# EAGLE schematic My GuitarPedal Schematic (EAGLE 9.6.2)
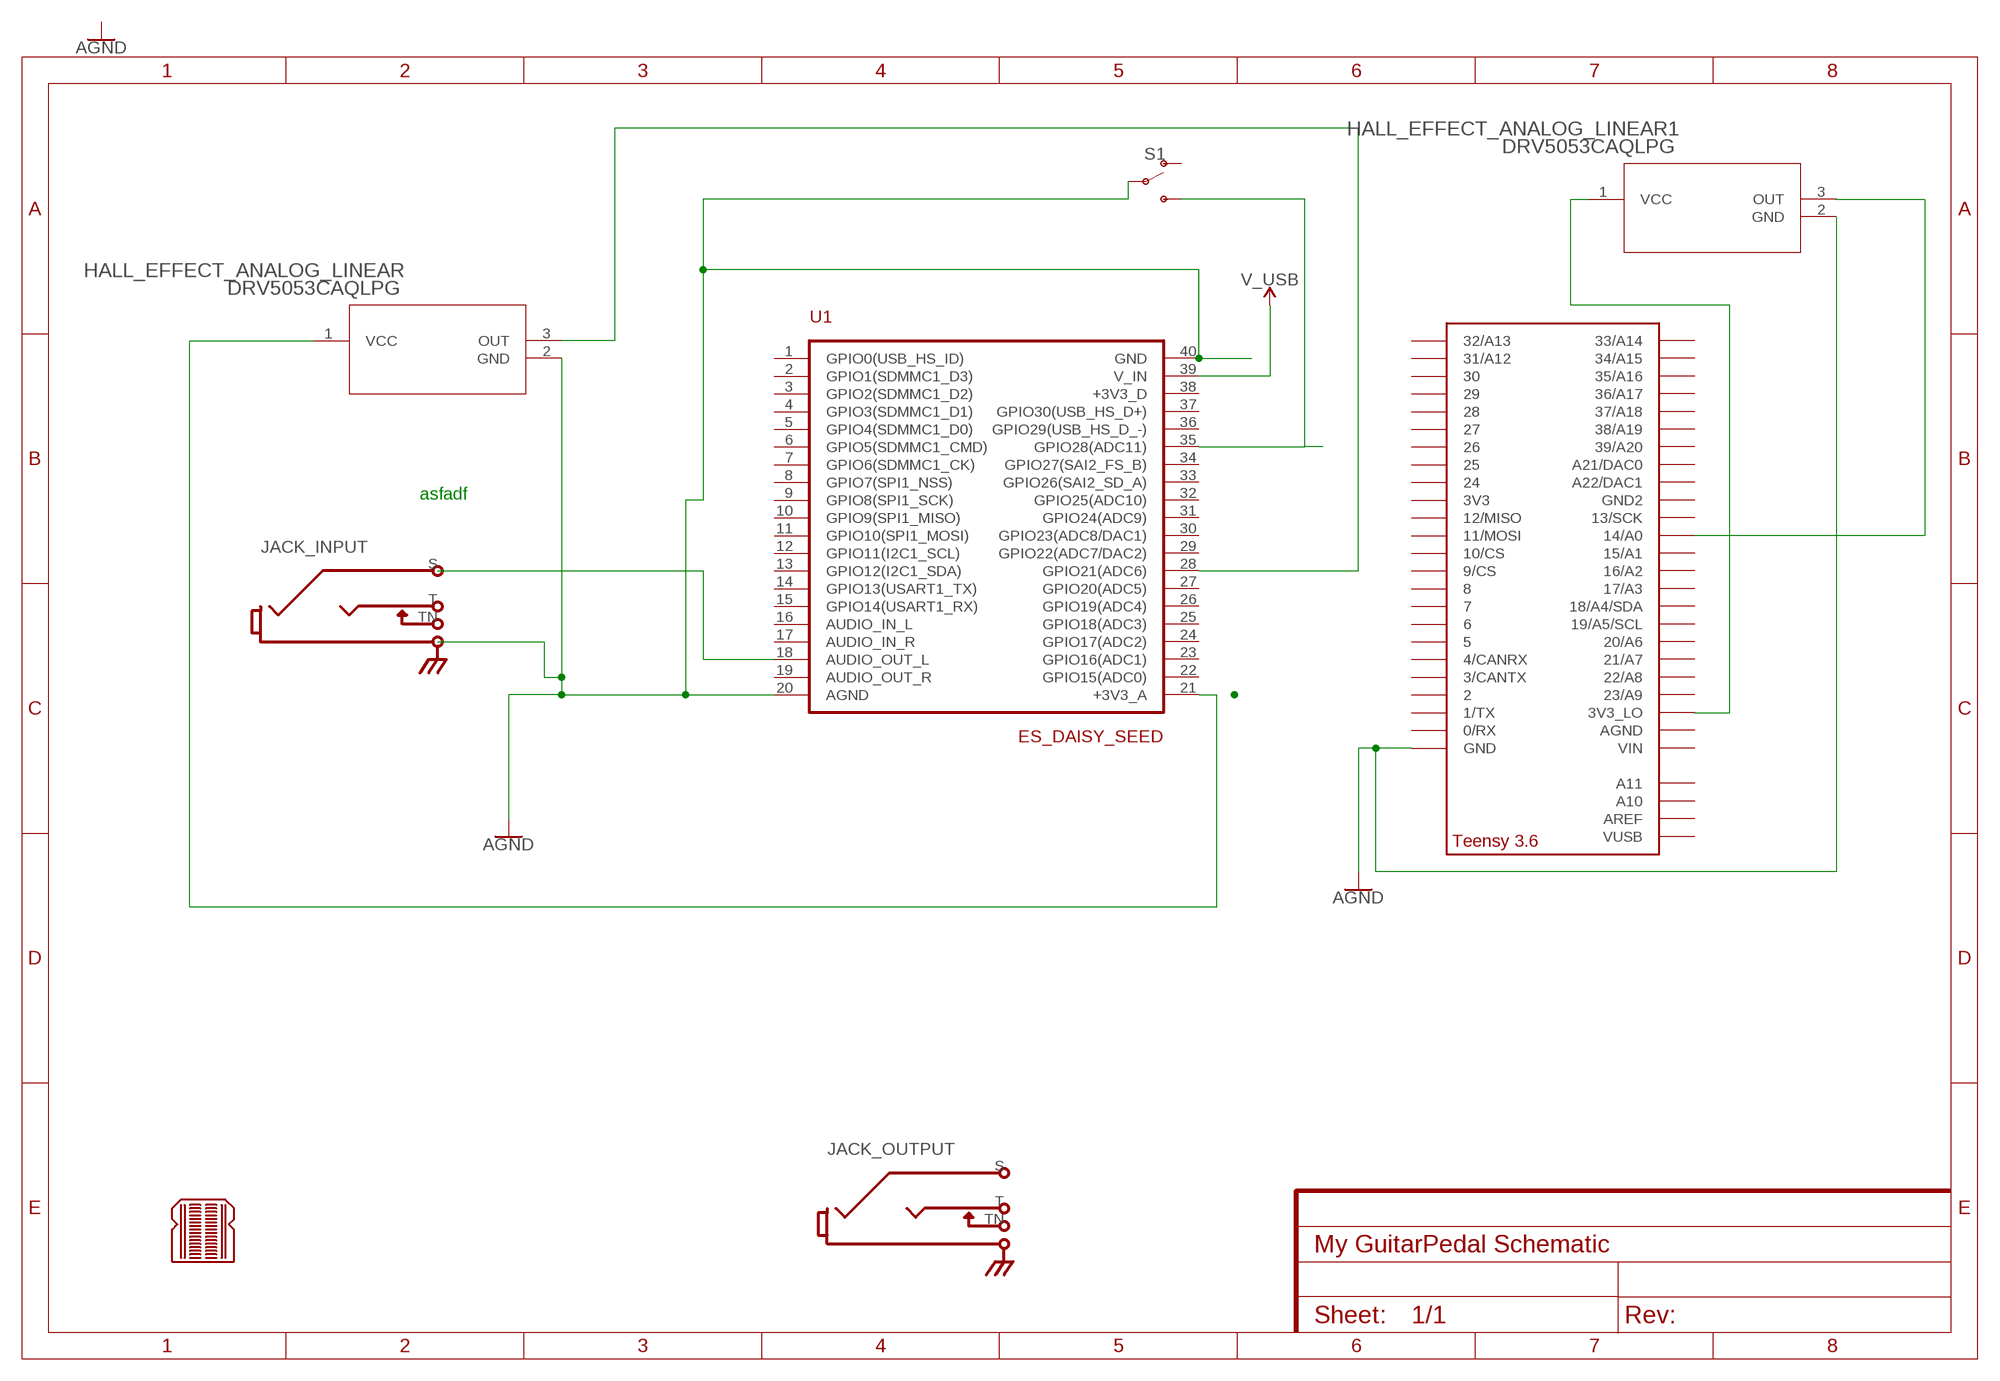
[diagram p0: schematic, sheet 1, part 1 of 2]
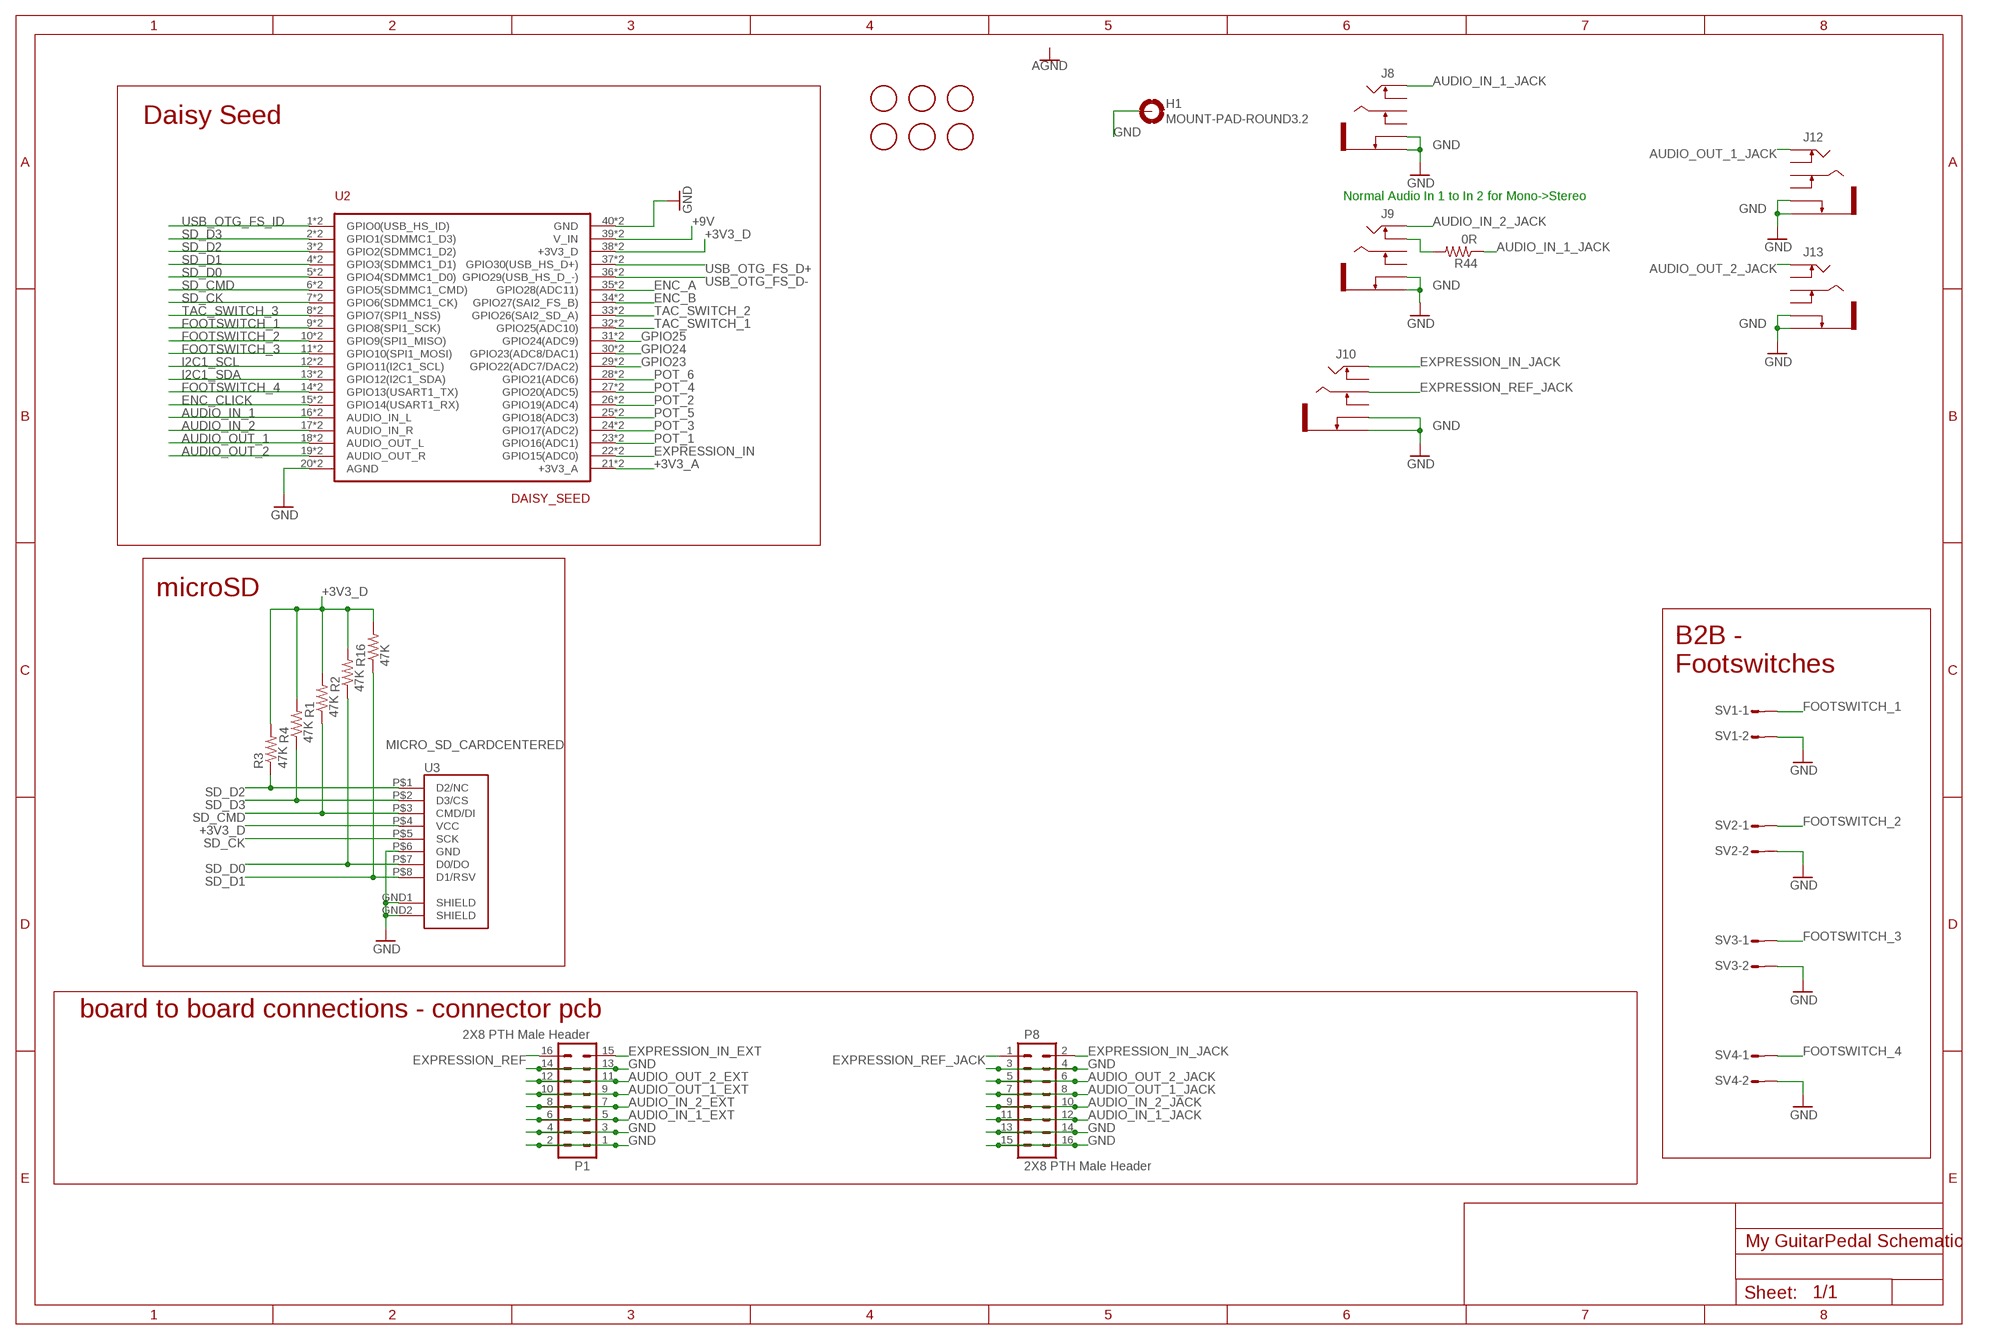
[diagram p1: schematic, sheet 1, part 2 of 2]

## Parts
FD1  FIDUCIAL  [FIDUCIAL_1MM]
FD2  FIDUCIAL  [FIDUCIAL_1MM]
FD3  FIDUCIAL  [FIDUCIAL_1MM]
FD4  FIDUCIAL  [FIDUCIAL_1MM]
FD5  FIDUCIAL  [FIDUCIAL_1MM]
FD6  FIDUCIAL  [FIDUCIAL_1MM]
H1  MOUNT-PAD-ROUND3.2  [3,2-PAD]
HALL_EFFECT_ANALOG_LINEAR  DRV5053CAQLPG  [LPG3_TEX]
HALL_EFFECT_ANALOG_LINEAR1  DRV5053CAQLPG  [LPG3_TEX]
J8  JACK_TRS_SWITCHING_WQP-PJ6110  [WQP-PJ6110]
J9  JACK_TRS_SWITCHING_WQP-PJ6110  [WQP-PJ6110]
J10  JACK_TRS_SWITCHING_WQP-PJ6110  [WQP-PJ6110]
J12  JACK_TRS_SWITCHING_WQP-PJ6110  [WQP-PJ6110]
J13  JACK_TRS_SWITCHING_WQP-PJ6110  [WQP-PJ6110]
JACK_INPUT  MONOSW1GND  [NEUTRIK-NRJ4HM-1]
JACK_OUTPUT  MONOSW1GND  [NEUTRIK-NRJ4HM-1]
LOGO1  BREADBOARD_PATTERN  [BREADBOARD_SPACING]
P1  2X8 PTH Male Header  M08X2  [2X8_SMD]
P8  2X8 PTH Male Header  M08X2_LOCK_SILK  [2X8_LOCK]
R1  47K  R-US_R0603  [R0603]
R2  47K  R-US_R0603  [R0603]
R3  47K  R-US_R0603  [R0603]
R4  47K  R-US_R0603  [R0603]
R16  47K  R-US_R0603  [R0603]
R44  0R  R-US_R0603  [R0603]
S1  SWITCH-SPDT-SMD-RIGHT-ANGLE  [SWITCH_SPST_SMD_A]
SV1  S02P  [S02P]
SV2  S02P  [S02P]
SV3  S02P  [S02P]
SV4  S02P  [S02P]
U1  ES_DAISY_SEED  [ES_DAISY_SEED]
U2  DAISY_SEED  ES_DAISY_SEED_REV4_DOUBLE  [ES_DAISY_SEED_DOUBLE]
U3  MICRO_SD_CARDCENTERED  [VERT_MICROSD_CENTERED]
U$2  TEENSY_3.5/3.6_BASIC  [TEENSY_3.5/3.6_BASIC]

## Nets
+3V3_A: U2.21(+3V3_A) U2.B21(+3V3_A)
+3V3_D: R1.2 R2.2 R3.2 R4.2 R16.2 U2.38(+3V3_D) U2.B38(+3V3_D) U3.P$4(VCC)
+9V: U2.39(V_IN) U2.B39(V_IN)
AGND: HALL_EFFECT_ANALOG_LINEAR1.2(GND) HALL_EFFECT_ANALOG_LINEAR.2(GND) S1.2(P) U1.20(AGND) U1.40(GND) U$2.GND
AUDIO_IN_1: U2.16(AUDIO_IN_L) U2.B16(AUDIO_IN_L)
AUDIO_IN_1_EXT: P1.5 P1.6
AUDIO_IN_1_JACK: J8.2(TIP) P8.11 P8.12 R44.1
AUDIO_IN_2: U2.17(AUDIO_IN_R) U2.B17(AUDIO_IN_R)
AUDIO_IN_2_EXT: P1.7 P1.8
AUDIO_IN_2_JACK: J9.2(TIP) P8.9 P8.10
AUDIO_OUT_1: U2.18(AUDIO_OUT_L) U2.B18(AUDIO_OUT_L)
AUDIO_OUT_1_EXT: P1.9 P1.10
AUDIO_OUT_1_JACK: J12.2(TIP) P8.7 P8.8
AUDIO_OUT_2: U2.19(AUDIO_OUT_R) U2.B19(AUDIO_OUT_R)
AUDIO_OUT_2_EXT: P1.11 P1.12
AUDIO_OUT_2_JACK: J13.2(TIP) P8.5 P8.6
ENC_A: U2.35(GPIO28(ADC11)) U2.B35(GPIO28(ADC11))
ENC_B: U2.34(GPIO27(SAI2_FS_B)) U2.B34(GPIO27(SAI2_FS_B))
ENC_CLICK: U2.15(GPIO14(USART1_RX)) U2.B15(GPIO14(USART1_RX))
EXPRESSION_IN: U2.22(GPIO15(ADC0)) U2.B22(GPIO15(ADC0))
EXPRESSION_IN_EXT: P1.15
EXPRESSION_IN_JACK: J10.2(TIP) P8.2
EXPRESSION_REF: P1.16
EXPRESSION_REF_JACK: J10.3(RING) P8.1
FOOTSWITCH_1: SV1.1 U2.9(GPIO8(SPI1_SCK)) U2.B9(GPIO8(SPI1_SCK))
FOOTSWITCH_2: SV2.1 U2.10(GPIO9(SPI1_MISO)) U2.B10(GPIO9(SPI1_MISO))
FOOTSWITCH_3: SV3.1 U2.11(GPIO10(SPI1_MOSI)) U2.B11(GPIO10(SPI1_MOSI))
FOOTSWITCH_4: SV4.1 U2.14(GPIO13(USART1_TX)) U2.B14(GPIO13(USART1_TX))
GND: H1.B3,2(MOUNT) J8.1(SLEEVE) J8.4(SLEEVE_SW) J9.1(SLEEVE) J9.4(SLEEVE_SW) J10.1(SLEEVE) J10.4(SLEEVE_SW) J12.1(SLEEVE) J12.4(SLEEVE_SW) J13.1(SLEEVE) J13.4(SLEEVE_SW) P1.1 P1.2 P1.3 P1.4 P1.13 P1.14 P8.3 P8.4 P8.13 P8.14 P8.15 P8.16 SV1.2 SV2.2 SV3.2 SV4.2 U2.20(AGND) U2.40(GND) U2.B20(AGND) U2.B40(GND) U3.GND1(SHIELD) U3.GND2(SHIELD) U3.P$6(GND)
GPIO23: U2.29(GPIO22(ADC7/DAC2)) U2.B29(GPIO22(ADC7/DAC2))
GPIO24: U2.30(GPIO23(ADC8/DAC1)) U2.B30(GPIO23(ADC8/DAC1))
GPIO25: U2.31(GPIO24(ADC9)) U2.B31(GPIO24(ADC9))
I2C1_SCL: U2.12(GPIO11(I2C1_SCL)) U2.B12(GPIO11(I2C1_SCL))
I2C1_SDA: U2.13(GPIO12(I2C1_SDA)) U2.B13(GPIO12(I2C1_SDA))
N$1: JACK_INPUT.S U1.18(AUDIO_OUT_L)
N$2: S1.3(S) U1.35(GPIO28(ADC11))
N$3: HALL_EFFECT_ANALOG_LINEAR.3(OUT) U1.28(GPIO21(ADC6))
N$4: HALL_EFFECT_ANALOG_LINEAR1.1(VCC) U$2.3V3_LO
N$5: HALL_EFFECT_ANALOG_LINEAR1.3(OUT) U$2.14/A0
N$6: HALL_EFFECT_ANALOG_LINEAR.1(VCC) U1.21(+3V3_A)
N$22: J9.5(TIP_SW) R44.2
POT_1: U2.23(GPIO16(ADC1)) U2.B23(GPIO16(ADC1))
POT_2: U2.26(GPIO19(ADC4)) U2.B26(GPIO19(ADC4))
POT_3: U2.24(GPIO17(ADC2)) U2.B24(GPIO17(ADC2))
POT_4: U2.27(GPIO20(ADC5)) U2.B27(GPIO20(ADC5))
POT_5: U2.25(GPIO18(ADC3)) U2.B25(GPIO18(ADC3))
POT_6: U2.28(GPIO21(ADC6)) U2.B28(GPIO21(ADC6))
SD_CK: U2.7(GPIO6(SDMMC1_CK)) U2.B7(GPIO6(SDMMC1_CK)) U3.P$5(SCK)
SD_CMD: R1.1 U2.6(GPIO5(SDMMC1_CMD)) U2.B6(GPIO5(SDMMC1_CMD)) U3.P$3(CMD/DI)
SD_D0: R2.1 U2.5(GPIO4(SDMMC1_D0)) U2.B5(GPIO4(SDMMC1_D0)) U3.P$7(D0/DO)
SD_D1: R16.1 U2.4(GPIO3(SDMMC1_D1)) U2.B4(GPIO3(SDMMC1_D1)) U3.P$8(D1/RSV)
SD_D2: R3.1 U2.3(GPIO2(SDMMC1_D2)) U2.B3(GPIO2(SDMMC1_D2)) U3.P$1(D2/NC)
SD_D3: R4.1 U2.2(GPIO1(SDMMC1_D3)) U2.B2(GPIO1(SDMMC1_D3)) U3.P$2(D3/CS)
TAC_SWITCH_1: U2.32(GPIO25(ADC10)) U2.B32(GPIO25(ADC10))
TAC_SWITCH_2: U2.33(GPIO26(SAI2_SD_A)) U2.B33(GPIO26(SAI2_SD_A))
TAC_SWITCH_3: U2.8(GPIO7(SPI1_NSS)) U2.B8(GPIO7(SPI1_NSS))
USB_OTG_FS_D+: U2.37(GPIO30(USB_HS_D+)) U2.B37(GPIO30(USB_HS_D+))
USB_OTG_FS_D-: U2.36(GPIO29(USB_HS_D_-)) U2.B36(GPIO29(USB_HS_D_-))
USB_OTG_FS_ID: U2.1(GPIO0(USB_HS_ID)) U2.B1(GPIO0(USB_HS_ID))
V_USB: U1.39(V_IN)
Unconnected: J8.3(RING) J8.5(TIP_SW) J8.6(RING_SW) J9.3(RING) J9.6(RING_SW) J10.5(TIP_SW) J10.6(RING_SW) J12.3(RING) J12.5(TIP_SW) J12.6(RING_SW) J13.3(RING) J13.5(TIP_SW) J13.6(RING_SW) JACK_INPUT.T JACK_INPUT.TN JACK_OUTPUT.S JACK_OUTPUT.T JACK_OUTPUT.TN S1.1(O) U1.1(GPIO0(USB_HS_ID)) U1.2(GPIO1(SDMMC1_D3)) U1.3(GPIO2(SDMMC1_D2)) U1.4(GPIO3(SDMMC1_D1)) U1.5(GPIO4(SDMMC1_D0)) U1.6(GPIO5(SDMMC1_CMD)) U1.7(GPIO6(SDMMC1_CK)) U1.8(GPIO7(SPI1_NSS)) U1.9(GPIO8(SPI1_SCK)) U1.10(GPIO9(SPI1_MISO)) U1.11(GPIO10(SPI1_MOSI)) U1.12(GPIO11(I2C1_SCL)) U1.13(GPIO12(I2C1_SDA)) U1.14(GPIO13(USART1_TX)) U1.15(GPIO14(USART1_RX)) U1.16(AUDIO_IN_L) U1.17(AUDIO_IN_R) U1.19(AUDIO_OUT_R) U1.22(GPIO15(ADC0)) U1.23(GPIO16(ADC1)) U1.24(GPIO17(ADC2)) U1.25(GPIO18(ADC3)) U1.26(GPIO19(ADC4)) U1.27(GPIO20(ADC5)) U1.29(GPIO22(ADC7/DAC2)) U1.30(GPIO23(ADC8/DAC1)) U1.31(GPIO24(ADC9)) U1.32(GPIO25(ADC10)) U1.33(GPIO26(SAI2_SD_A)) U1.34(GPIO27(SAI2_FS_B)) U1.36(GPIO29(USB_HS_D_-)) U1.37(GPIO30(USB_HS_D+)) U1.38(+3V3_D) U$2.0/RX U$2.1/TX U$2.2 U$2.3/CANTX U$2.3V3 U$2.4/CANRX U$2.5 U$2.6 U$2.7 U$2.8 U$2.9/CS U$2.10/CS U$2.11/MOSI U$2.12/MISO U$2.13/SCK U$2.15/A1 U$2.16/A2 U$2.17/A3 U$2.18/A4/SDA U$2.19/A5/SCL U$2.20/A6 U$2.21/A7 U$2.21/DAC0(A21/DAC0) U$2.22/A8 U$2.23/A9 U$2.24 U$2.25 U$2.26 U$2.27 U$2.28 U$2.29 U$2.30 U$2.31/A12 U$2.32/A13 U$2.33/A14 U$2.34/A15 U$2.35/A16 U$2.36/A17 U$2.37/A18 U$2.38/A19 U$2.39/A20 U$2.A10 U$2.A11 U$2.A22/DAC1 U$2.AGND U$2.AREF U$2.GND2 U$2.VIN U$2.VUSB

## Notes on the sheet
- asfadf
- Daisy Seed
- Normal Audio In 1 to In 2 for Mono->Stereo
- microSD
- B2B - 
  Footswitches
- board to board connections - connector pcb

## Library data of the parts
FD1-FD6 = Electrosmith-Connectors:FIDUCIAL: For use by pick and place machines to calibrate the vision/machine, 1mm By microbuilder.eu
H1 = holes:MOUNT-PAD-ROUND: MOUNTING PAD, round
HALL_EFFECT_ANALOG_LINEAR HALL_EFFECT_ANALOG_LINEAR1 = drv5053:DRV5053CAQLPG; COPYRIGHT: Copyright (C) 2022 Ultra Librarian. All rights reserved.; MANUFACTURER_PART_NUMBER: DRV5053CAQLPG; MFR_NAME: Texas Instruments
J8-J10 J12 J13 = Electrosmith-Interface:JACK_TRS_SWITCHING
JACK_INPUT JACK_OUTPUT = Audio Jacks 0.25 inch:MONOSW1GND: 1/4" mono jack, switched (unswitched sleeve), with chassis ground connection
LOGO1 = SparkFun-Aesthetics:BREADBOARD_PATTERN: Breadboard-Spacing Reference tDoc reference markings that correspond to solderless breadboard row spacing. Includes power rails and void space between rows.
P1 = Electrosmith-Connectors:M08X2?; LABEL: TO JACK PCB
P8 = Electrosmith-Connectors:M08X2?; LABEL: solder on this side
R1-R4 R16 R44 = Electrosmith-Passives:R-US_: RESISTOR, American symbol; PACKAGE: R0603
S1 = SparkFun-Switches:SWITCH-SPDT: Single Pole, Double Throw (SPDT) Switch Single-pole, double-throw (SPDT) switch. Variant Overview SMD-AYZ0202 Surface Mount DPDT Switch <https://www.sparkfun.com/products/597> (COM-00597) Used on e.g. LilyPad Arduino USB - ATmega32U4 Board <https://www.sparkfun.com/products/12049> PTH-11.6X4.0MM SPDT Mini Power Switch <https://www.sparkfun.com/products/102> (COM-00102) Used on e.g. SparkFun Simon Says - Through-Hole Soldering Kit <https://www.sparkfun.com/products/10547> (KIT-10547) PTH-11.6X4.0MM-KIT KIT version of SPDT Mini Power Switch - Simplifies soldering by removing tStop of switch pins - only one side can be soldered. PTH-11.6X4.0MM-LOCK LOCK version of SPDT Mini Power Switch - Offset pins hold switch in place for easier soldering. SMD-RIGHT-ANGLE Surface Mount Right Angle Switch <https://www.sparkfun.com/products/10860> (COM-10860) Used on e.g. SparkFun ESP8266 Thing <https://www.sparkfun.com/products/13231>; PROD_ID: SWCH-10651; SF_SKU: COM-10860
SV1-SV4 = con-amp-mt:S02P: AMP MT CONNECTOR; OC_FARNELL: unknown; OC_NEWARK: unknown
U1 = Electrosmith_Boards (1):ES_DAISY_SEED; IPN: Daisy Seed
U2 = Electrosmith-Boards:ES_DAISY_SEED_REV4
U3 = Electrosmith-Interface:MICRO_SD_CARD
U$2 = Teensy356:TEENSY_3.5/3.6_BASIC